# EasyEDA Pro project ProPrj_ESP32 Drone_2026-05-29.epro

# Schematic Schematic1

## Sheets
1 P1: Board Name: Board1; Create Date: 2025-12-19; Page Name: P1; Project Name: ESP32 Drone; Schematic Name: Schematic1; Update Date: 2026-03-31; Company: Sprig Labs; Drawn: K. Paraskevas; Page Size: A4; Version: V1.0
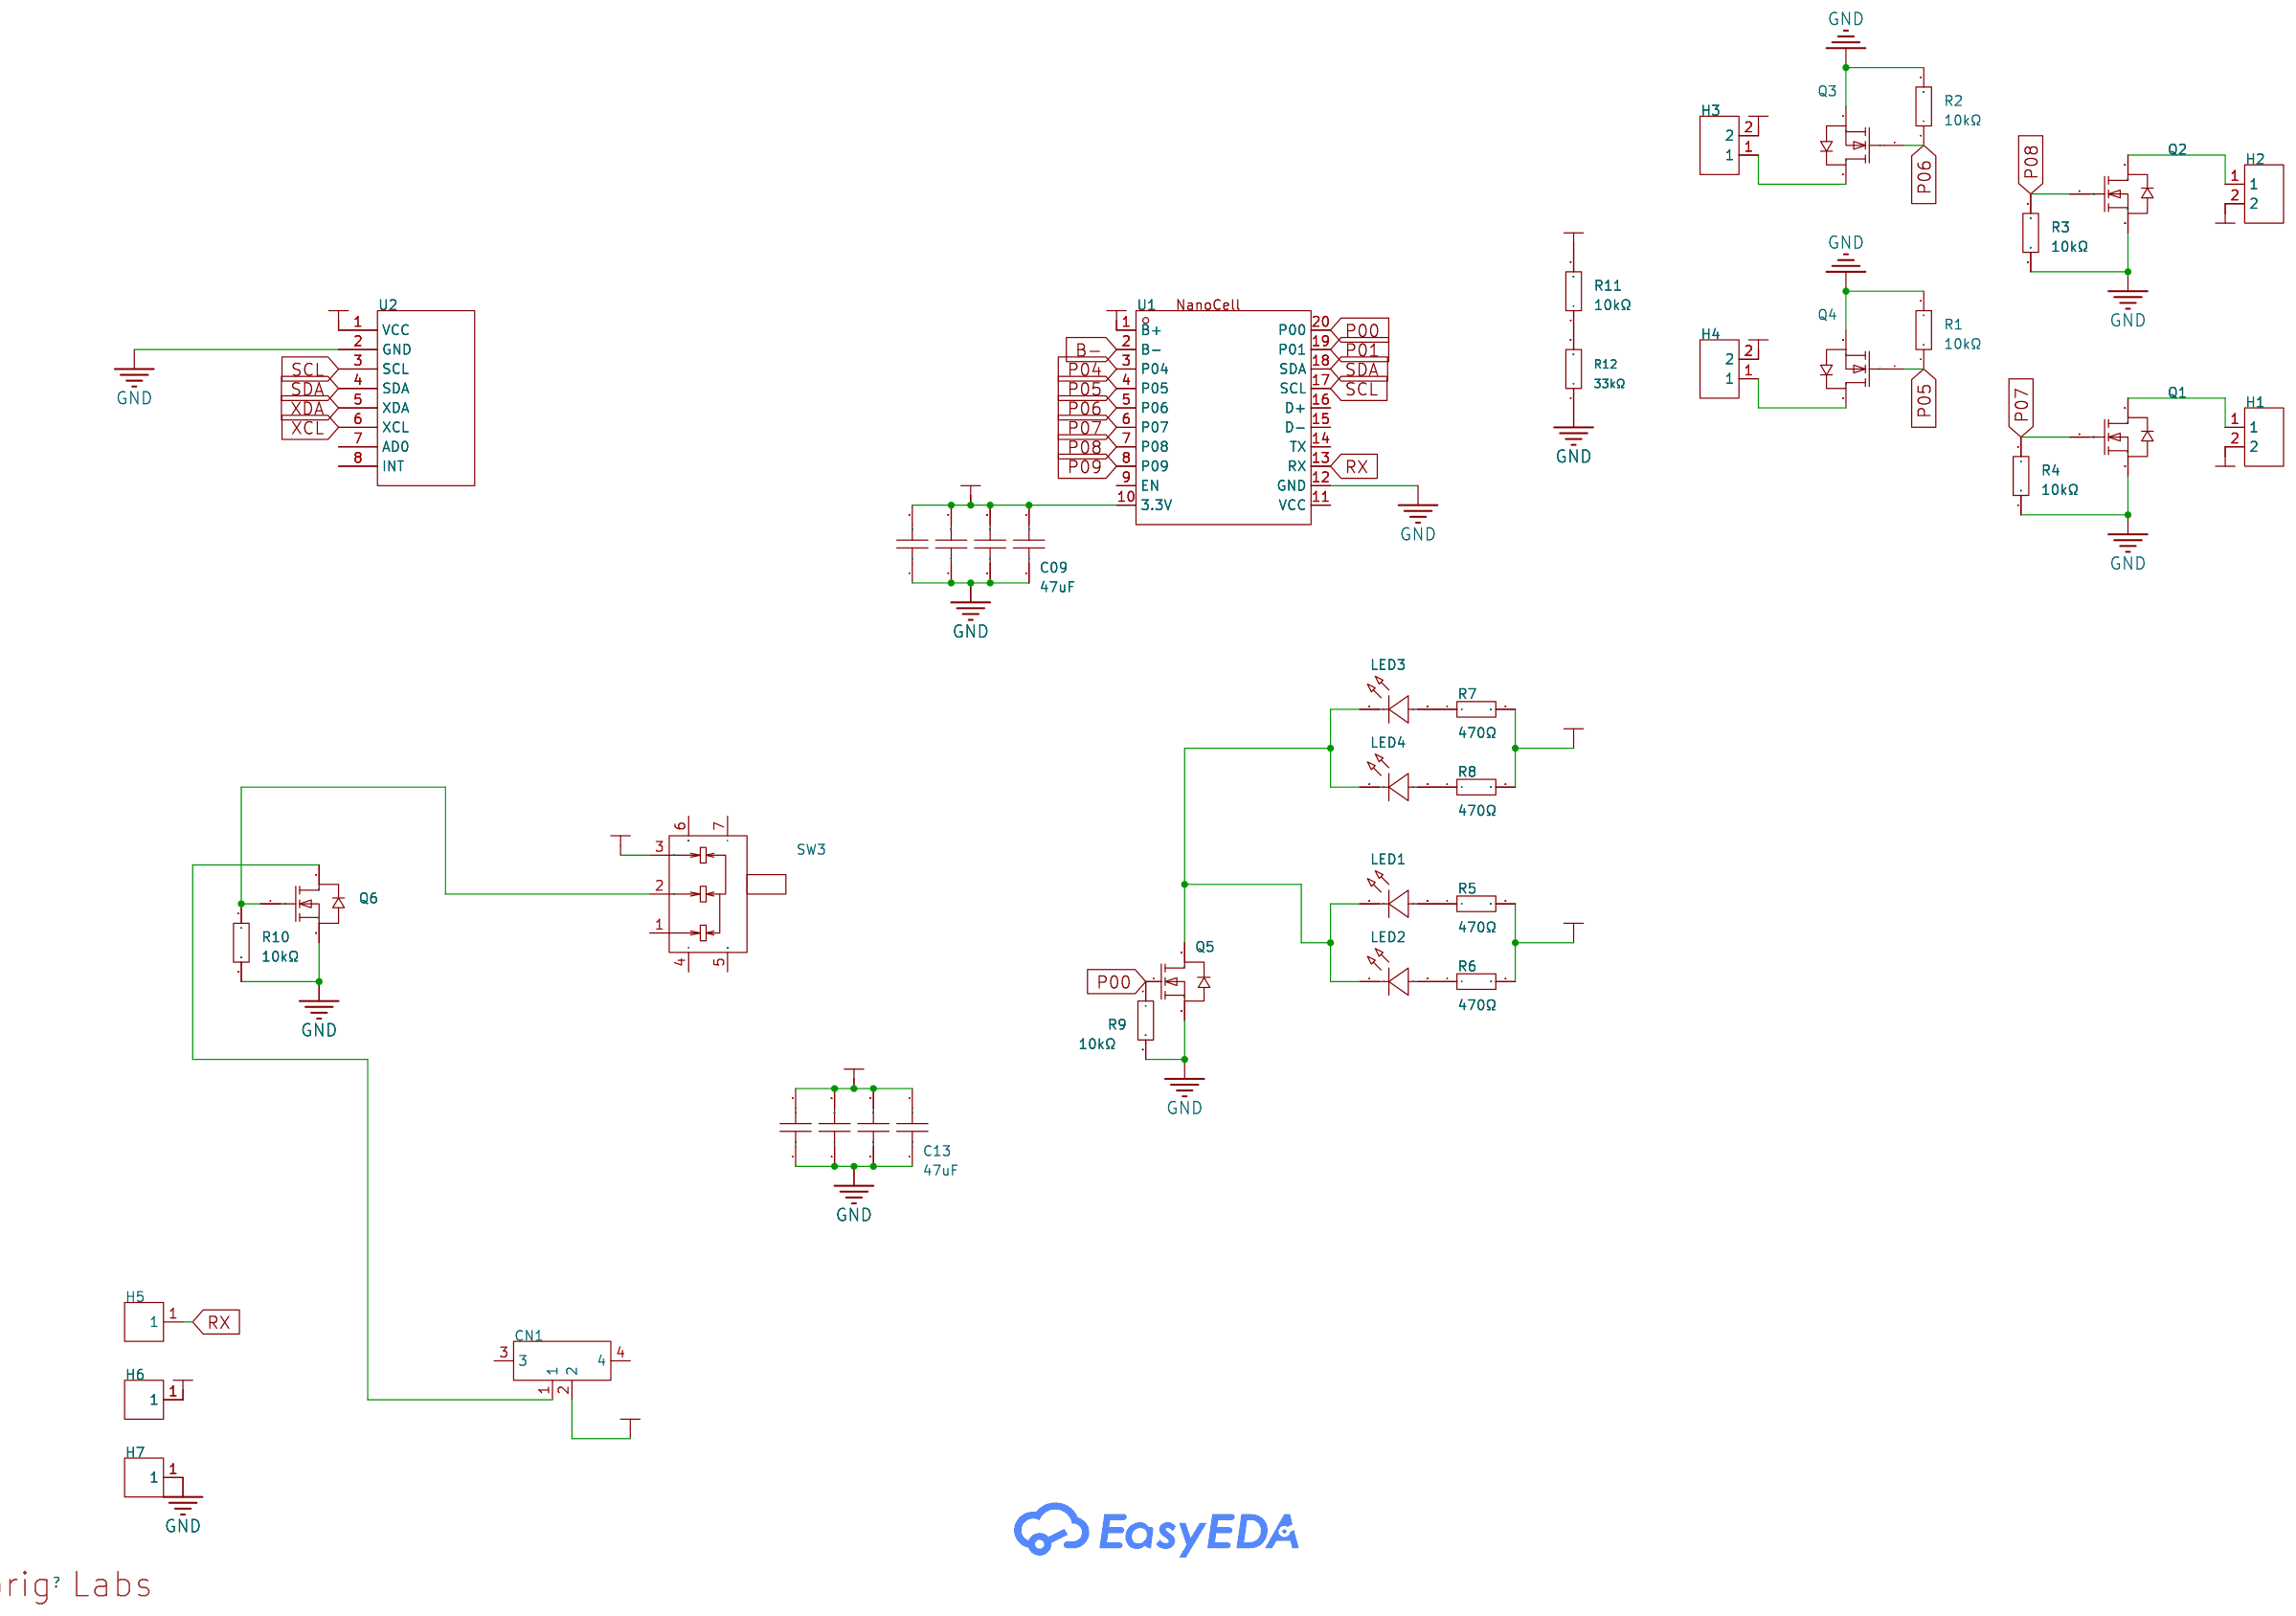
[diagram p0: P1]
2 P2: Create Date: 2026-03-29; Page Name: P2
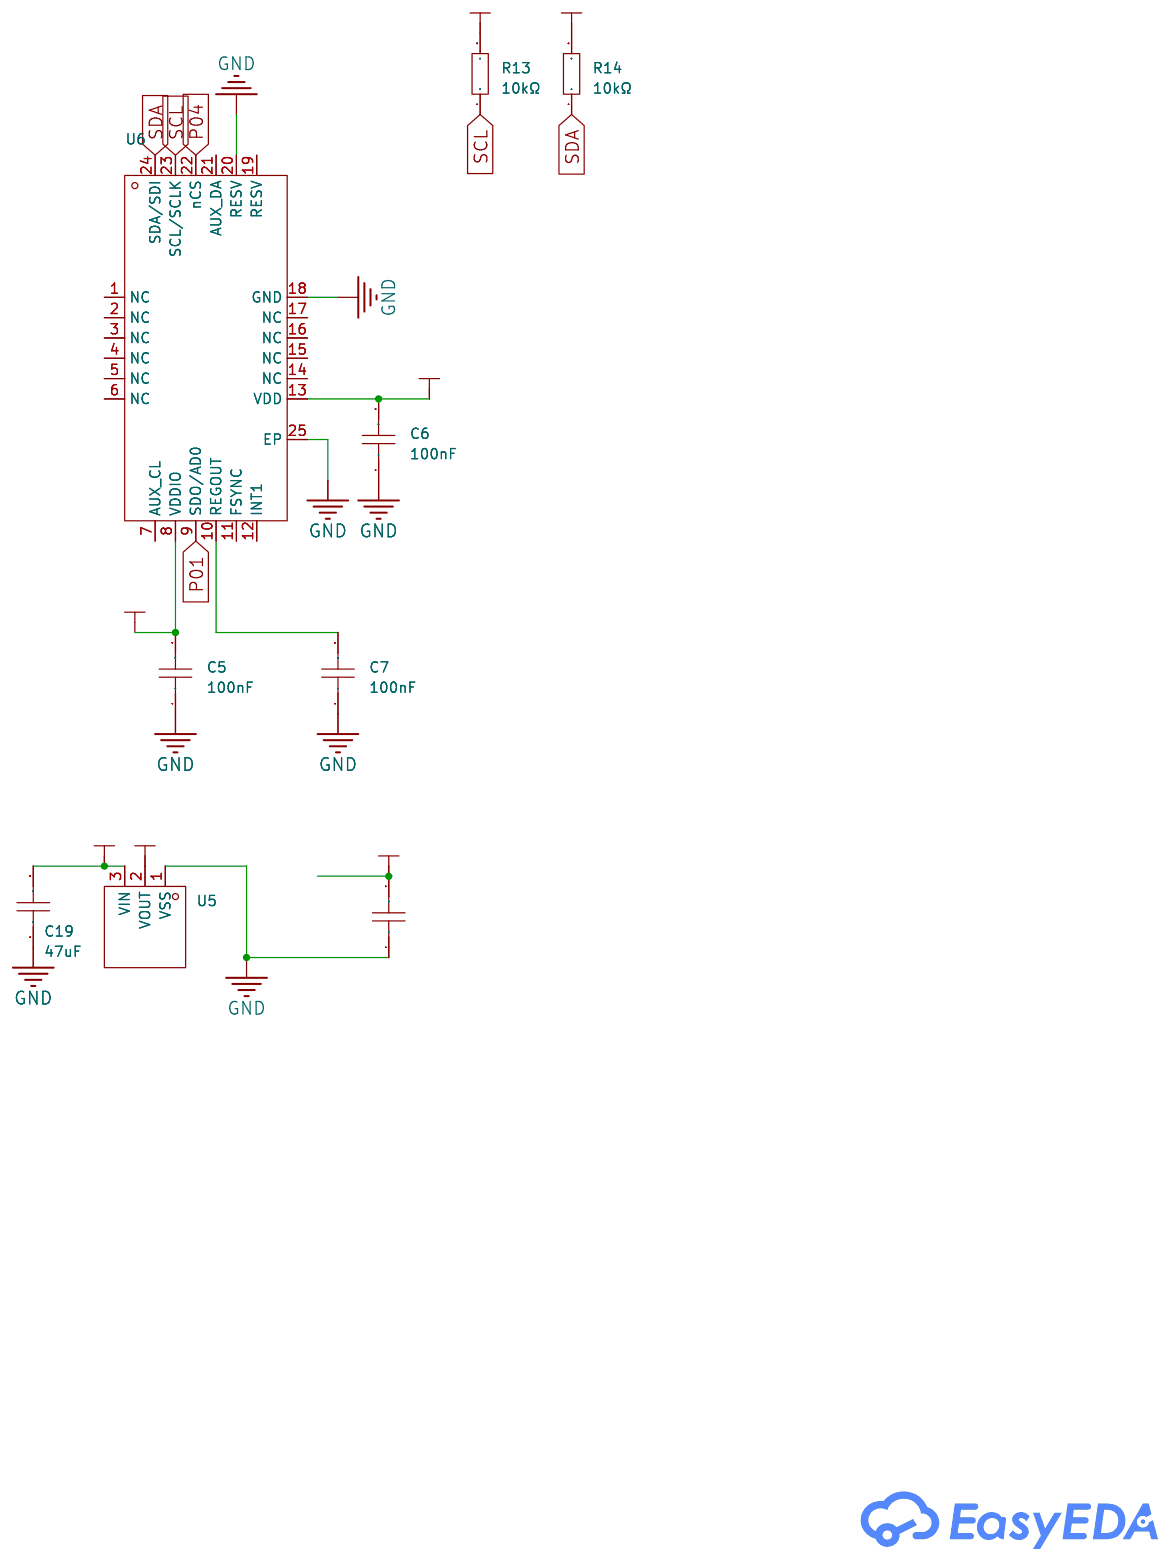
[diagram p1: P2]

## Parts
sheet P1
C09  47uF  [C0805]
C10  47uF  [C0805]
C11  47uF  [C0805]
C12  47uF  [C0805]
C13  47uF  [C0805]
C14  47uF  [C0805]
C15  47uF  [C0805]
C16  47uF  [C0805]
CN1  HX PH2.0-2PWT  [CONN-SMD_2P-P2.00]
H1  KF332J-3.5-2P BLACK  [HDR-TH_2P-P3.50-V-M_1]
H2  KF332J-3.5-2P BLACK  [HDR-TH_2P-P3.50-V-M_1]
H3  KF332J-3.5-2P BLACK  [HDR-TH_2P-P3.50-V-M_1]
H4  KF332J-3.5-2P BLACK  [HDR-TH_2P-P3.50-V-M_1]
H5  TMM-101-01-G-S  [HDR-TH_TMM-101-06-L-S]
H6  TMM-101-01-G-S  [HDR-TH_TMM-101-06-L-S]
H7  TMM-101-01-G-S  [HDR-TH_TMM-101-06-L-S]
LED1  XL-1608SURC-06  [LED0603-RD_RED]
LED2  XL-1608SURC-06  [LED0603-RD_RED]
LED3  PSC-1608U50GC-G4  [LED0603-RD_GREEN]
LED4  PSC-1608U50GC-G4  [LED0603-RD_GREEN]
Q1  100N03A  [TO-252-2_L6.6-W6.1-P4.57-LS9.9-BR-CW]
Q2  100N03A  [TO-252-2_L6.6-W6.1-P4.57-LS9.9-BR-CW]
Q3  100N03A  [TO-252-2_L6.6-W6.1-P4.57-LS9.9-BR-CW]
Q4  100N03A  [TO-252-2_L6.6-W6.1-P4.57-LS9.9-BR-CW]
Q5  SI2302-HXY  [SOT-23-3_L2.9-W1.3-P1.90-LS2.4-BR]
Q6  100N03A  [TO-252-2_L6.6-W6.1-P4.57-LS9.9-BR-CW]
R1  10kΩ  [R0603]
R2  10kΩ  [R0603]
R3  10kΩ  [R0603]
R4  10kΩ  [R0603]
R5  470Ω  [R0603]
R6  470Ω  [R0603]
R7  470Ω  [R0603]
R8  470Ω  [R0603]
R9  10kΩ  [R0603]
R10  10kΩ  [R0603]
R11  10kΩ  [R0603]  (no BOM)
R12  33kΩ  [R0603]  (no BOM)
SW3  MK-12C03-G015  [SW-SMD_MK-12C03-G015]
U1  -  [NanoCell]
U2  -  [MPU-6050 module]
sheet P2
C5  100nF  [C0603]
C6  100nF  [C0603]
C7  100nF  [C0603]
C17  47uF  [C0805]
C19  47uF  [C0805]
R13  10kΩ  [R0603]
R14  10kΩ  [R0603]
U5  XC6206P182MR  [SOT-23-3_L2.9-W1.6-P1.90-LS2.8-BR]
U6  ICM-20948  [QFN-24_L3.0-W3.0-P0.40-BL-EP]

## Library data of the parts
C09-C17 C19 = JMK212BJ476MG-T: Capacitance:47uF Tolerance:±20% Tolerance:±20% Voltage Rating:6.3V Temperature Coefficient:X5R; LCSC Part Name: 47uF ±20% 6.3V; Supplier Part: C87159; Manufacturer: TAIYO YUDEN(太诱); Supplier Footprint: 0805; JLCPCB Part Class: Extended Part; Datasheet: https://item.szlcsc.com/datasheet/JMK212BJ476MG-T/88337.html; Supplier: LCSC; Tolerance: ±20%; Voltage Rating: 6.3V; Temperature Coefficient: X5R
CN1 = HX PH2.0-2PWT: Pins Structure:1x2P Pitch:2mm Mounting Type:Surface Mount, Right Angle Reference Series:PH Number of Pins:2P Number of Rows:1 Number of PINs Per Row:2 Row Spacing:- Current Rating:2A Contact Material:Brass Contact Plating:Tin Operating Temperature:-25℃~+8; LCSC Part Name: 1x2P 间距:2mm 卧贴 系列:PH; Supplier Part: C22461285; Manufacturer: hanxia(韩下); Supplier Footprint: SMD,P=2mm,卧贴; JLCPCB Part Class: Extended Part; Datasheet: https://item.szlcsc.com/datasheet/HX%2520PH2.0-2PWT/24139203.html; Supplier: LCSC; Pins Structure: 1x2P; Pitch: 2mm; Mounting Type: Surface Mount, Right Angle; Reference Series: PH; Number of Pins: 2P; Number of Rows: 1; Number of PINs Per Row: 2; Current Rating: 2A; Contact Material: Brass; Contact Plating: Tin; Operating Temperature: -25℃~+85℃; Voltage Rating: 100V; Plastic Material: LCP; Flame Retardant Rating: UL94V-0; Color: Beige
H1-H4 = KF332J-3.5-2P BLACK: Pin Structure:1x2P Pitch:3.5mm Row Spacing:- Circluar Pins/Square Pins:Round Pin Mounting Type:Through Hole Number of Rows:1 Number of Pins:2P Insulation Height:2mm Length of End Connection Pin:3.5mm Contact Material:Copper alloy Contact Plating:Tin Opera; LCSC Part Name: 1x2P 间距:3.5mm 圆针 直插; Supplier Part: C19711761; Manufacturer: KEFA(科发); Supplier Footprint: 插件,P=3.5mm; JLCPCB Part Class: Extended Part; Datasheet: https://item.szlcsc.com/datasheet/KF332J-3.5-2P%2520BLACK/21021586.html; Supplier: LCSC; Pin Structure: 1x2P; Pitch: 3.5mm; Circluar Pins/Square Pins: Round Pin; Mounting Type: Through Hole; Number of Rows: 1; Number of Pins: 2P; Insulation Height: 2mm; Length of End Connection Pin: 3.5mm; Contact Material: Copper alloy; Contact Plating: Tin; Operating Temperature: -30℃~+120℃; Color: Black
H5-H7 = TMM-101-01-G-S: Mounting Type:Through Hole Number of Rows:1 Number of Pins:1P Current Rating:3.2A Contact Material:Phosphor Bronze Contact Plating:Gold Operating Temperature:-55℃~+125℃ Operating Temperature:-55℃~+125℃ Color:Black; LCSC Part Name: 直插; Supplier Part: C5986197; Manufacturer: SAMTEC; Supplier Footprint: 插件; JLCPCB Part Class: Extended Part; Datasheet: https://item.szlcsc.com/datasheet/TMM-101-01-G-S/6924381.html; Supplier: LCSC; Mounting Type: Through Hole; Number of Rows: 1; Number of Pins: 1P; Current Rating: 3.2A; Contact Material: Phosphor Bronze; Contact Plating: Gold; Operating Temperature: -55℃~+125℃; Color: Black
LED1 LED2 = XL-1608SURC-06: Lamp Holder Type:- Illumination Color:Red Voltage - Forward(Vf):2.3V Voltage - Forward(Vf):2.3V Power(Watts):50mW Forward Current:20mA Wavelength - Dominant:620nm~630nm Wavelength - Dominant:620nm~630nm Peak Wavelength:625nm Diode Configuration:- Lens Col; LCSC Part Name: 0603红色贴片式发光二极管; Supplier Part: C965799; Manufacturer: XINGLIGHT(成兴光); Supplier Footprint: 0603; JLCPCB Part Class: Extended Part; Datasheet: https://item.szlcsc.com/datasheet/XL-1608SURC-06/1051408.html; Supplier: LCSC; Illumination Color: Red; Voltage - Forward(Vf): 2.3V; Power(Watts): 50mW; Forward Current: 20mA; Wavelength - Dominant: 620nm~630nm; Peak Wavelength: 625nm; Lens Color: Water Clear; Luminous Intensity: 225mcd; Viewing Angle: 120°; Mounting Style: op View Mount; Operating Temperature: -40℃~+85℃
LED3 LED4 = PSC-1608U50GC-G4: Illumination Color:Green Voltage - Forward(Vf):3.2V Voltage - Forward(Vf):3.2V Power(Watts):66mW Forward Current:10mA Wavelength - Dominant:517nm~527nm Wavelength - Dominant:517nm~527nm Lens Color:Water Clear Luminous Intensity:1000mcd Luminous Intensity:; LCSC Part Name: 钻孔1608高亮绿灯; Supplier Part: C22371298; Manufacturer: HONGLITRONIC(鸿利光电); Supplier Footprint: 0603; JLCPCB Part Class: Extended Part; Datasheet: https://item.szlcsc.com/datasheet/PSC-1608U50GC-G4/23857065.html; Supplier: LCSC; Illumination Color: Green; Voltage - Forward(Vf): 3.2V; Power(Watts): 66mW; Forward Current: 10mA; Wavelength - Dominant: 517nm~527nm; Lens Color: Water Clear; Luminous Intensity: 1000mcd; Viewing Angle: 130°; Operating Temperature: -40℃~+85℃
Q1-Q4 Q6 = 100N03A: Number:1 N-Channel Drain to Source Voltage:30V Current - Continuous Drain(Id):90A RDS(on):3.8mΩ@10V；6.4mΩ@4.5V Pd - Power Dissipation:105W Gate Threshold Voltage (Vgs(th)):1.7V@250uA Gate Charge(Qg):41nC@10V Input Capacitance(Ciss):1.963nF@15V Reverse Tra; LCSC Part Name: 1个N沟道 耐压:30V 电流:90A; Supplier Part: C668200; Manufacturer: UMW(友台半导体); Supplier Footprint: TO-252; JLCPCB Part Class: Extended Part; Datasheet: https://item.szlcsc.com/datasheet/100N03A/698048.html; Supplier: LCSC; Number: 1 N-Channel; Drain to Source Voltage: 30V; Current - Continuous Drain(Id): 90A; RDS(on): 3.8mΩ@10V；6.4mΩ@4.5V; Pd - Power Dissipation: 105W; Gate Threshold Voltage (Vgs(th)): 1.7V@250uA; Gate Charge(Qg): 41nC@10V; Input Capacitance(Ciss): 1.963nF@15V; Reverse Transfer Capacitance (Crss@Vds): 221pF; Operating Temperature: -55℃~+150℃; Type: N-Channel
Q5 = SI2302-HXY: Type:1 N-channel Drain Source Voltage (Vdss): Continuous Drain Current (Id): Drain Source On Resistance (RDS(on)@Vgs,Id):55mΩ@4.5V,2.8A Power Dissipation (Pd):900mW Gate Threshold Voltage (Vgs(th)@Id):1.2V@250uA Total Gate Charge (Qg@Vgs):5nC@4.5V Input C; LCSC Part Name: 1个N沟道 耐压:20V 电流:2.8A; Supplier Part: C4748714; Manufacturer: HXY MOSFET(华轩阳电子); Supplier Footprint: SOT-23; JLCPCB Part Class: Extended Part; Datasheet: https://atta.szlcsc.com/upload/public/pdf/source/20220720/B2EC63D46AD65363D9D3692163B46869.pdf; Supplier: LCSC; Type: 1 N-channel; Drain Source On Resistance (RDS(on)@Vgs,Id): 55mΩ@4.5V,2.8A; Power Dissipation (Pd): 900mW; Gate Threshold Voltage (Vgs(th)@Id): 1.2V@250uA; Total Gate Charge (Qg@Vgs): 5nC@4.5V; Input Capacitance (Ciss@Vds): 260pF; Reverse Transfer Capacitance (Crss@Vds): 27pF; Operating Temperature: -55℃~+150℃
R1-R4 R9-R11 R13 R14 = 0603WAF1002T5E: Type:Thick Film Resistor Resistance:10kΩ Tolerance:±1% Tolerance:±1% Power(Watts):100mW Voltage-Supply(Max):75V Temperature Coefficient:±100ppm/℃ Temperature Coefficient:±100ppm/℃ Operating Temperature:-55℃~+155℃ Operating Temperature:-55℃~+155℃; LCSC Part Name: 厚膜电阻 10kΩ ±1% 100mW; Supplier Part: C25804; Manufacturer: UNI-ROYAL(厚声); Supplier Footprint: 0603; JLCPCB Part Class: Basic Part; Datasheet: https://item.szlcsc.com/datasheet/0603WAF1002T5E/26547.html; Supplier: LCSC; Type: Thick Film Resistor; Tolerance: ±1%; Power(Watts): 100mW; Voltage-Supply(Max): 75V; Temperature Coefficient: ±100ppm/℃; Operating Temperature: -55℃~+155℃
R5-R8 = 0603WAF4700T5E: Type:Thick Film Resistor Resistance:470Ω Tolerance:±1% Tolerance:±1% Power(Watts):100mW Voltage-Supply(Max):75V Temperature Coefficient:±100ppm/℃ Temperature Coefficient:±100ppm/℃ Operating Temperature:-55℃~+155℃ Operating Temperature:-55℃~+155℃; LCSC Part Name: 470Ω ±1% 100mW 厚膜电阻; Supplier Part: C23179; Manufacturer: UNI-ROYAL(厚声); Supplier Footprint: 0603; JLCPCB Part Class: Basic Part; Datasheet: https://item.szlcsc.com/datasheet/0603WAF4700T5E/23906.html; Supplier: LCSC; Type: Thick Film Resistor; Tolerance: ±1%; Power(Watts): 100mW; Voltage-Supply(Max): 75V; Temperature Coefficient: ±100ppm/℃; Operating Temperature: -55℃~+155℃
R12 = 0603WAF3302T5E: Type:Thick Film Resistor Resistance:33kΩ Tolerance:±1% Tolerance:±1% Power(Watts):100mW Voltage-Supply(Max):75V Temperature Coefficient:±100ppm/℃ Temperature Coefficient:±100ppm/℃ Operating Temperature:-55℃~+155℃ Operating Temperature:-55℃~+155℃; LCSC Part Name: 33kΩ ±1% 100mW 厚膜电阻; Supplier Part: C4216; Manufacturer: UNI-ROYAL(厚声); Supplier Footprint: 0603; JLCPCB Part Class: Basic Part; Datasheet: https://item.szlcsc.com/datasheet/0603WAF3302T5E/4623.html; Supplier: LCSC; Type: Thick Film Resistor; Tolerance: ±1%; Power(Watts): 100mW; Voltage-Supply(Max): 75V; Temperature Coefficient: ±100ppm/℃; Operating Temperature: -55℃~+155℃
SW3 = MK-12C03-G015: Circuit:SPDT Actuator Style:Rectangular columnar Pin Style:SMDSplicing Switch Length:6.65mm Switch Width:2.75mm Switch Height:4.25mm Mounting Style:卧贴 Actuator Color:White Current Rating (DC):1A Voltage Rating (DC):6V Mechanical Life:1万次 Operating Tempera; LCSC Part Name: 新七脚小拨动开关 G1.5mm; Supplier Part: C2890358; Manufacturer: G-Switch(品赞); Supplier Footprint: SMD; JLCPCB Part Class: Extended Part; Datasheet: https://atta.szlcsc.com/upload/public/pdf/source/20240612/7D979AF25627BA0CE326E7EBF8EC90FA.pdf; Supplier: LCSC; Circuit: SPDT; Actuator Style: Rectangular columnar; Pin Style: SMDSplicing; Switch Length: 6.65mm; Switch Width: 2.75mm; Switch Height: 4.25mm; Mounting Style: 卧贴; Actuator Color: White; Current Rating (DC): 1A; Voltage Rating (DC): 6V; Mechanical Life: 1万次; Operating Temperature: -20℃~+70℃
U1 = NanoCell
U2 = MPU-6050 module
C5-C7 = CC0603KRX7R9BB104: Capacitance:100nF Tolerance:±10% Tolerance:±10% Voltage Rating:50V Temperature Coefficient:X7R; LCSC Part Name: 100nF ±10% 50V; Supplier Part: C14663; Manufacturer: YAGEO(国巨); Supplier Footprint: 0603; JLCPCB Part Class: Basic Part; Datasheet: https://item.szlcsc.com/datasheet/CC0603KRX7R9BB104/15331.html; Supplier: LCSC; Tolerance: ±10%; Voltage Rating: 50V; Temperature Coefficient: X7R
U5 = XC6206P182MR_C22466430: Output Type:Fixed Maximum Input Voltage:6.5V Output Voltage:1.8V Output Voltage:1.8V Output Current:- Power Supply Rejection Ratio (PSRR):- Feature:Short-Circuit  Protection；Overcurrent Protection(OCP) Operating Temperature:-40℃~+85℃ Operating Temperature; LCSC Part Name: 线性稳压器(LDO); Supplier Part: C22466430; Manufacturer: TDSEMIC(拓电半导体); Supplier Footprint: SOT-23-3; JLCPCB Part Class: Extended Part; Datasheet: https://atta.szlcsc.com/upload/public/pdf/source/20240614/B6555AFA0F407D7F7E5A5C102A178C3B.pdf; Supplier: LCSC; Output Type: Fixed; Maximum Input Voltage: 6.5V; Output Voltage: 1.8V; Feature: Short-Circuit  Protection；Overcurrent Protection(OCP); Operating Temperature: -40℃~+85℃; Output Polarity: Positive electrode; Number of Outputs: 1
U6 = ICM-20948: Accelerometer Sensing Axis:X,Y,Z Acceleration Measurement Range (MAX):±16g Acceleration Measurement Range (MAX):±16g Gyroscope Sensing Axis:X,Y,Z Gyroscope Measurement Range (MAX):±2000dps Gyroscope Measurement Range (MAX):±2000dps Sensor Type:Acceleromet; LCSC Part Name: 九轴MEMS运动追踪器件; Supplier Part: C726001; Manufacturer: TDK InvenSense(应美盛); Supplier Footprint: QFN-24(3x3); JLCPCB Part Class: Extended Part; Datasheet: https://item.szlcsc.com/datasheet/ICM-20948/772651.html; Supplier: LCSC; Accelerometer Sensing Axis: X,Y,Z; Acceleration Measurement Range (MAX): ±16g; Gyroscope Sensing Axis: X,Y,Z; Gyroscope Measurement Range (MAX): ±2000dps; Sensor Type: Accelerometer Gyroscope; Output Bits: 16bit; Interface: I2C；SPI; Voltage - Supply: 1.71V~3.6V; Cache Size: 0.5KB; Standby Current: 8uA; Operating Temperature: -40℃~+85℃

## Nets
1.8V: C5.2 C17.2 R13.2 R14.2 U5.2(VOUT) U6.8(VDDIO)
+3.3V: C6.2 C09.2 C10.2 C11.2 C12.2 C19.2 H6.1 U1.10(3.3V) U2.1(VCC) U5.3(VIN) U6.13(VDD)
+VBAT: C13.2 C14.2 C15.2 C16.2 CN1.2 H1.2 H2.2 H3.2 H4.2 R5.2 R6.2 R7.2 R8.2 R11.2 SW3.3 U1.1(B+)
GND: C5.1 C6.1 C7.1 C09.1 C10.1 C11.1 C12.1 C13.1 C14.1 C15.1 C16.1 C17.1 C19.1 H7.1 Q1.3(S) Q2.3(S) Q3.3(S) Q4.3(S) Q5.2(S) Q6.3(S) R1.2 R2.2 R3.2 R4.2 R9.2 R10.2 R12.1 U1.12(GND) U2.2(GND) U5.1(VSS) U6.18(GND) U6.20(RESV) U6.25(EP)
B-: U1.2(B-)
P00: Q5.1(G) R9.1 U1.20(P00)
P01: R11.1 R12.2 U1.19(P01) U6.9(SDO/AD0)
P04: U1.3(P04) U6.22(nCS)
P05: Q4.1(G) R1.1 U1.4(P05)
P06: Q3.1(G) R2.1 U1.5(P06)
P07: Q1.1(G) R4.1 U1.6(P07)
P08: Q2.1(G) R3.1 U1.7(P08)
P09: U1.8(P09)
RX: H5.1 U1.13(RX)
SCL: R13.1 U1.17(SCL) U2.3(SCL) U6.23(SCL/SCLK)
SDA: R14.1 U1.18(SDA) U2.4(SDA) U6.24(SDA/SDI)
XCL: U2.6(XCL)
XDA: U2.5(XDA)
$1N990: H3.1 Q3.2(D)
$1N1042: H4.1 Q4.2(D)
$1N1143: H1.1 Q1.2(D)
$1N1147: H2.1 Q2.2(D)
$1N3735: LED1.2(A) R5.1
$1N3774: LED2.2(A) R6.1
$1N3813: LED3.2(A) R7.1
$1N3852: LED4.2(A) R8.1
$1N5655: LED1.1(K) LED2.1(K) LED3.1(K) LED4.1(K) Q5.3(D)
$1N12497: Q6.1(G) R10.1 SW3.2
$2N590: C7.2 U6.10(REGOUT)
Net-(CN1-1): CN1.1 Q6.2(D)

Not connected (* = marked no-connect by the designer): CN1 3 4; SW3 1 4 5 6 7; U1 9(EN) 11(VCC) 14(TX) 15(D-) 16(D+); U2 7(AD0) 8(INT); U6 1(NC) 2(NC) 3(NC) 4(NC) 5(NC) 6(NC) 7(AUX_CL) 11(FSYNC) 12(INT1) 14(NC) 15(NC) 16(NC) 17(NC) 19(RESV) 21(AUX_DA)

# Board PCB1
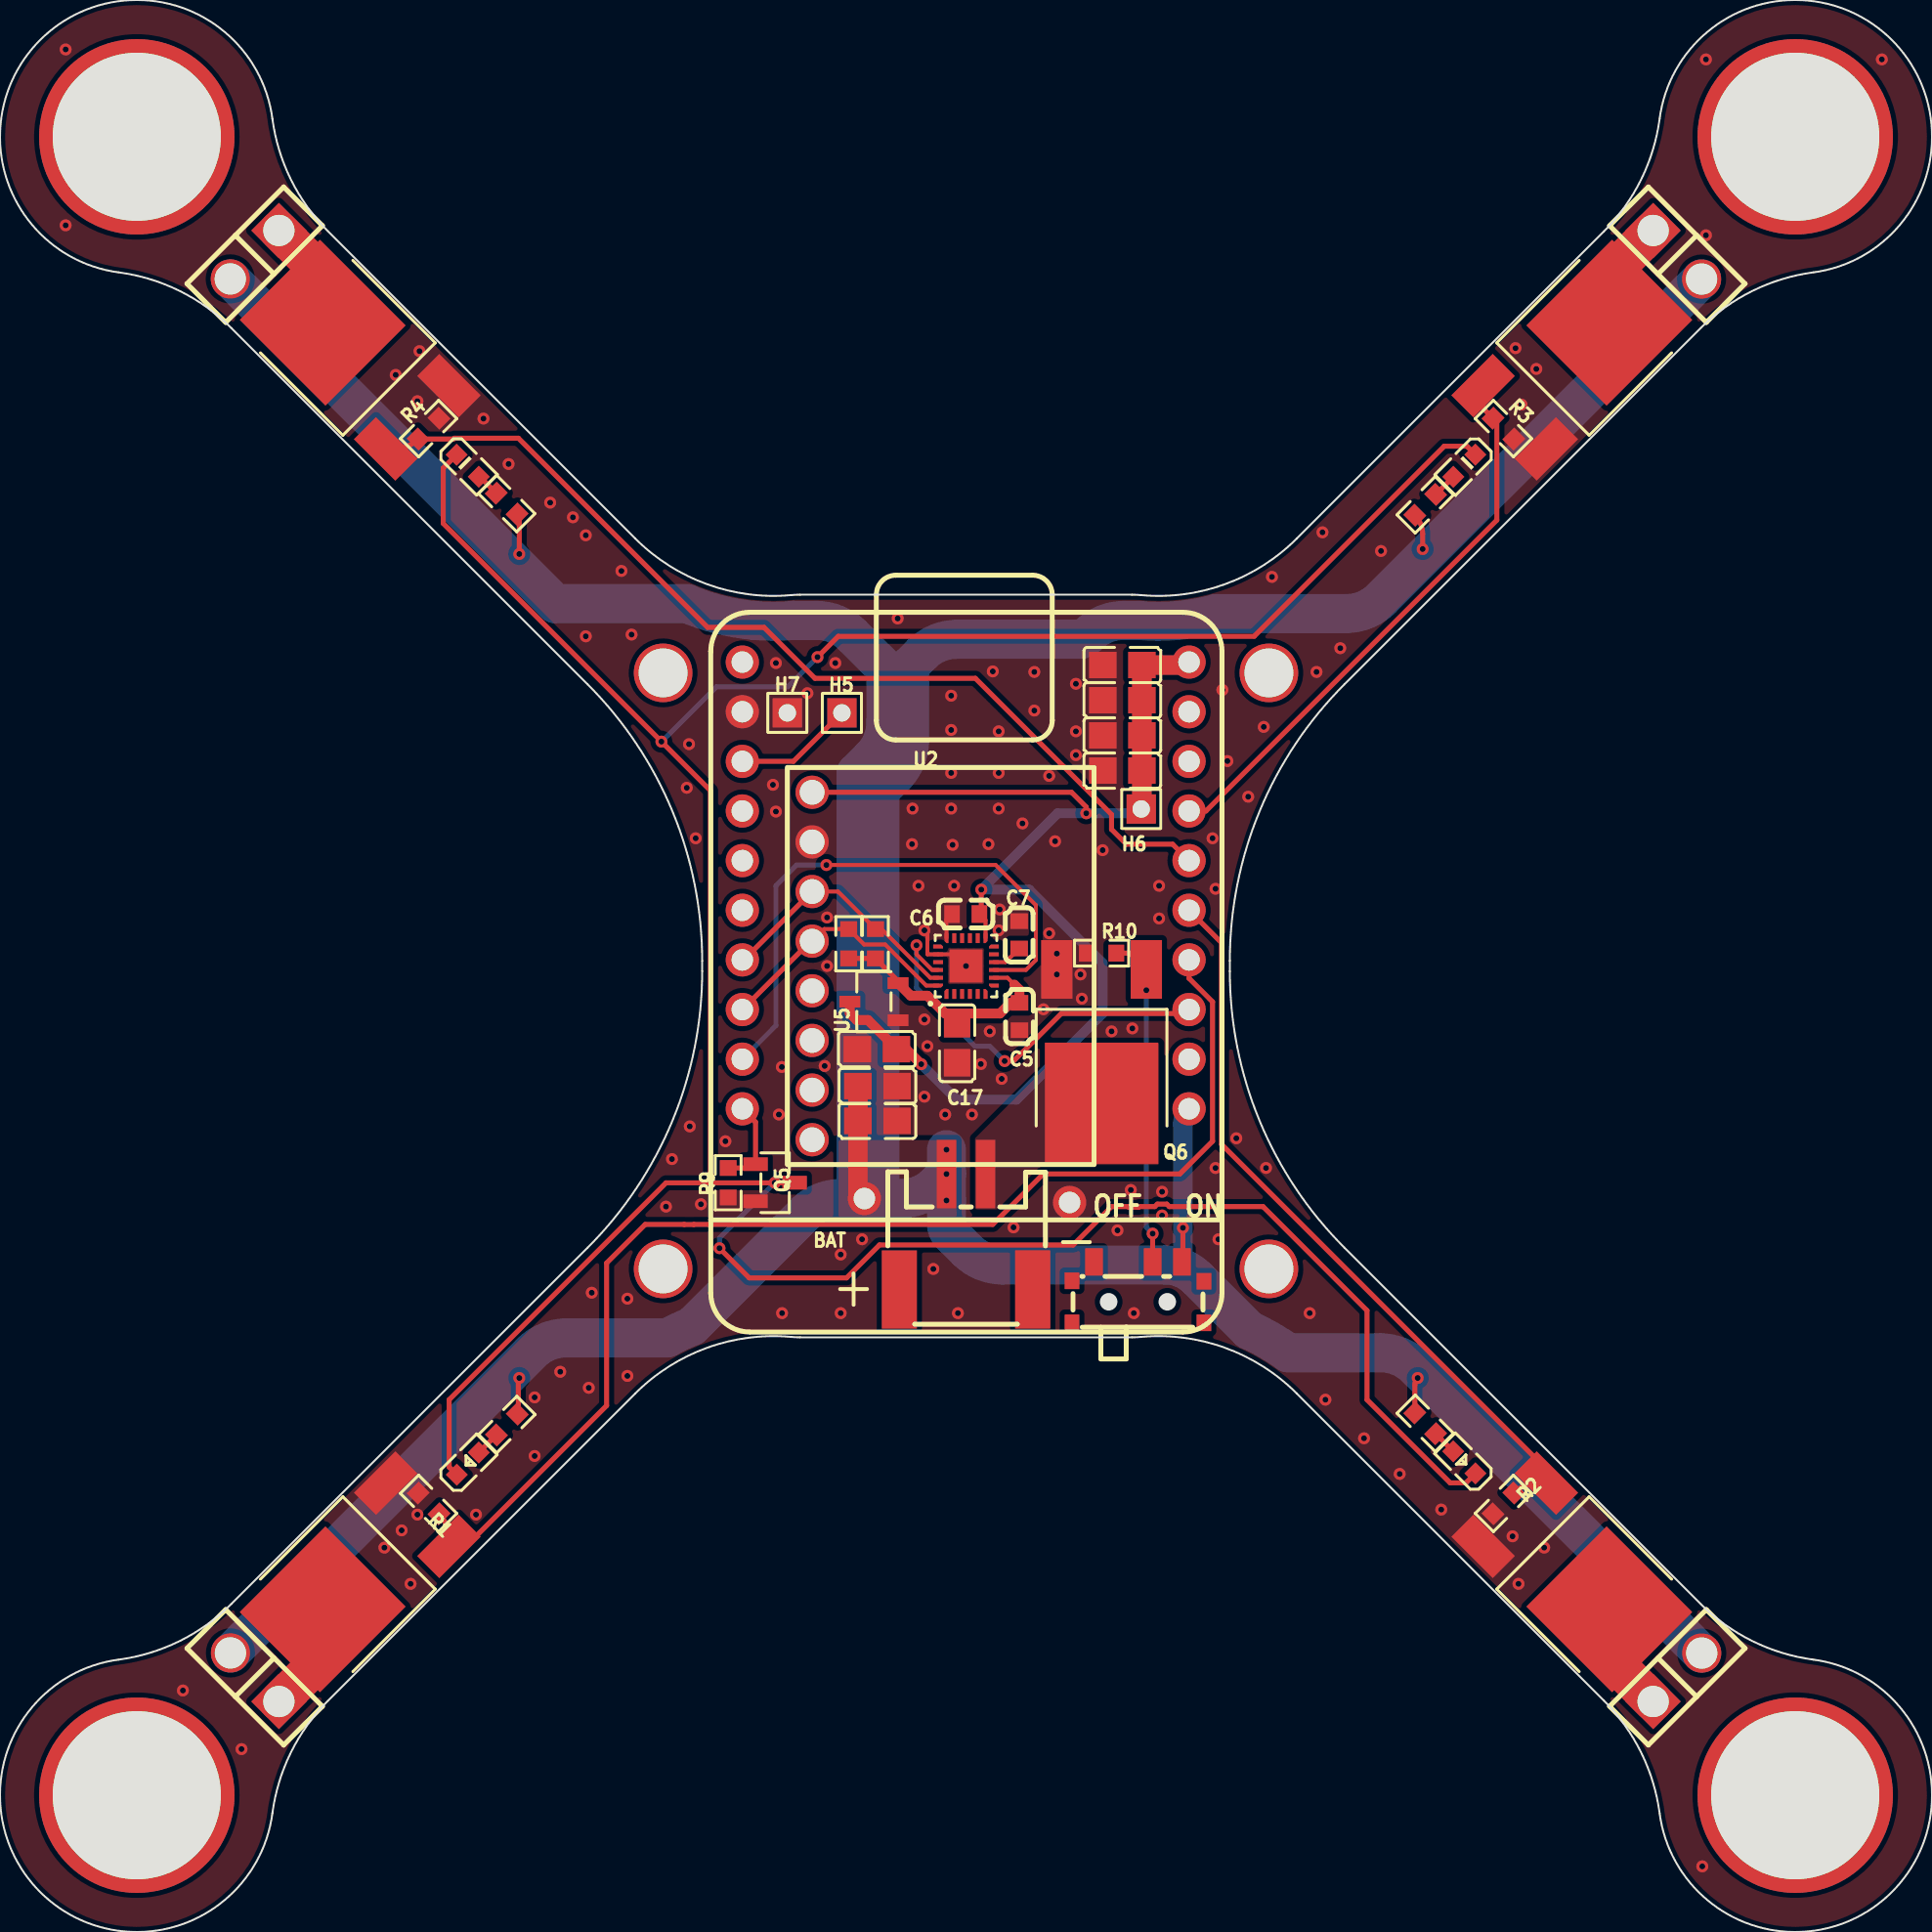
[diagram p2: board, top side]
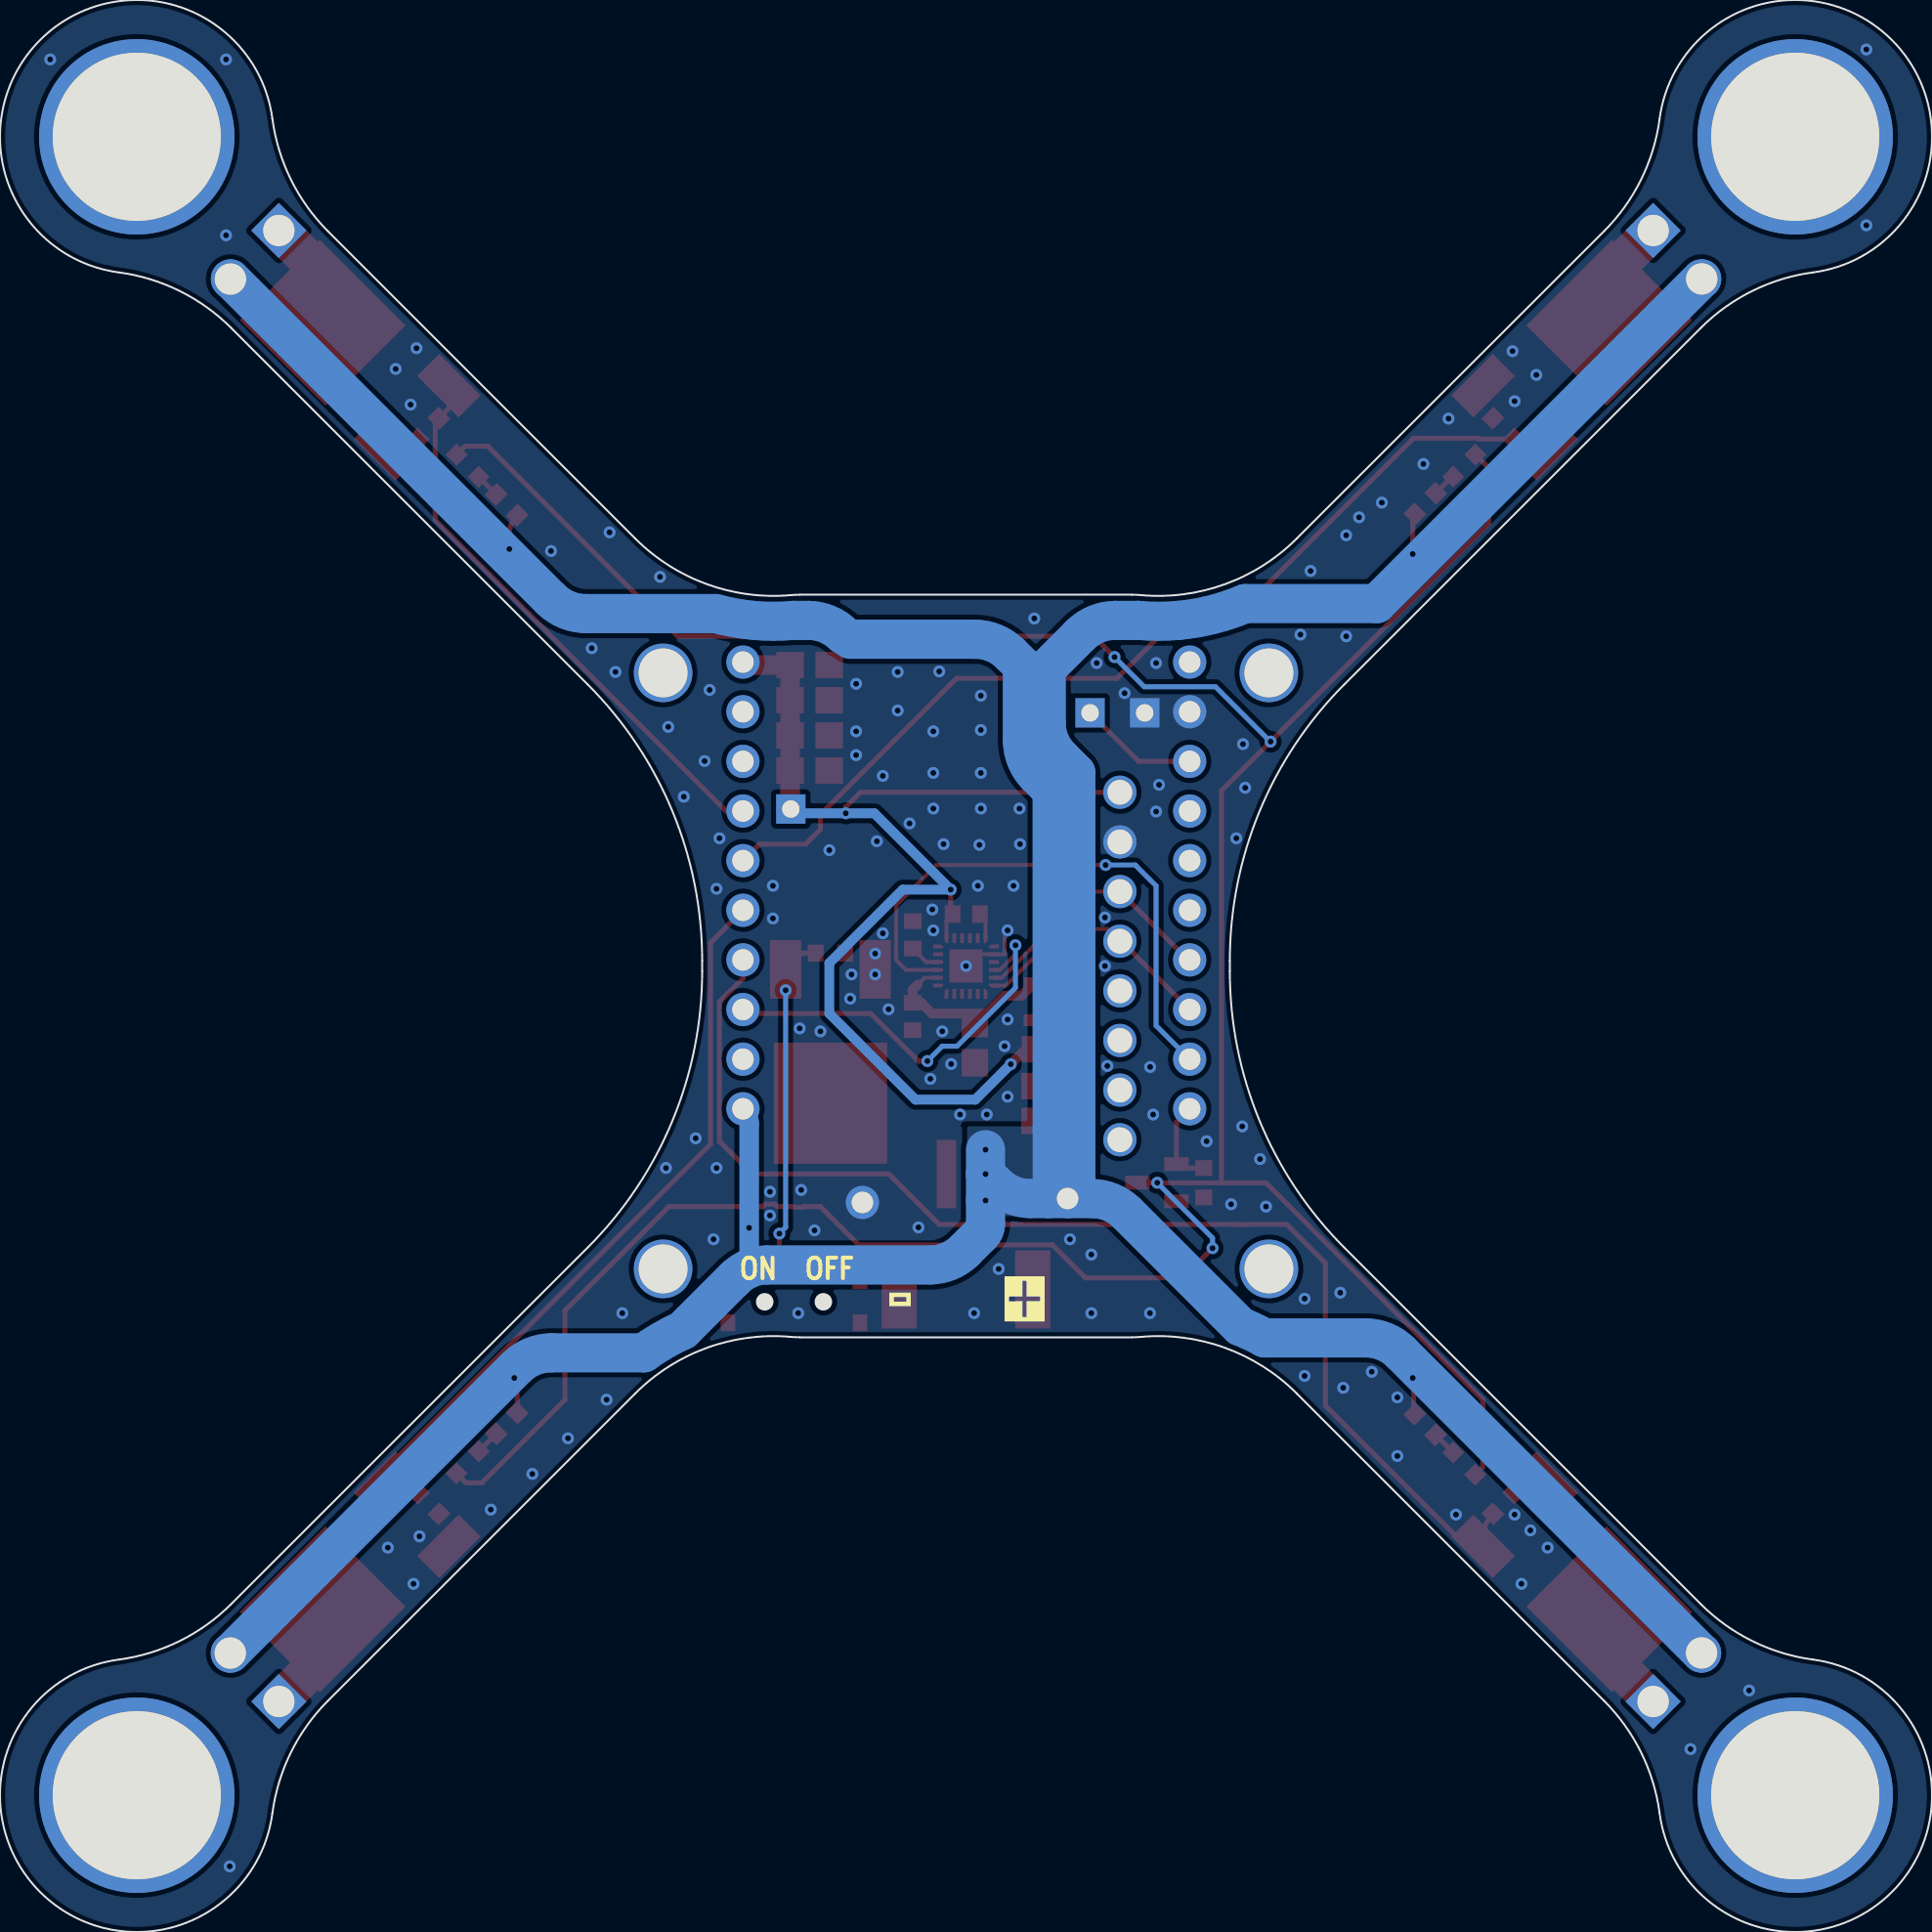
[diagram p3: board, bottom side, seen from below]

Outline 98.87 x 98.87 mm; copper layers: Top Layer, Bottom Layer. Coordinates in mm from the lower left corner of the outline.
Outline path: 6.08,84.93 arc(9.19,83.98) 11.83,82.08 30.07,63.84 arc(34.41,57.35) 35.93,49.7 35.93,49.17 arc(34.41,41.51) 30.07,35.02 11.83,16.78 arc(9.19,14.89) 6.08,13.94 arc(2.05,2.05) 13.94,6.08 arc(14.89,9.19) 16.78,11.83 32.51,27.56 arc(36.18,29.89) 40.48,30.45 arc(40.71,30.44) 40.93,30.43 57.93,30.43 arc(58.16,30.44) 58.38,30.45 arc(62.69,29.89) 66.35,27.56 82.08,11.83 arc(83.98,9.19) 84.93,6.08 arc(96.81,2.05) 92.79,13.94 arc(89.68,14.89) 87.03,16.78 68.79,35.02 arc(64.45,41.51) 62.93,49.17 62.93,49.7 arc(64.45,57.35) 68.79,63.84 87.03,82.08 arc(89.68,83.98) 92.79,84.93 arc(96.81,96.81) 84.93,92.79 arc(83.98,89.68) 82.08,87.03 66.35,71.3 arc(62.69,68.97) 58.38,68.41 arc(58.16,68.43) 57.93,68.43 40.93,68.43 arc(40.71,68.43) 40.48,68.41 arc(36.18,68.97) 32.51,71.3 16.78,87.03 arc(14.89,89.68) 13.94,92.79 arc(2.05,96.81) 6.08,84.93
Stack: Top Layer 0.035mm / Dielectric1 1.51mm FR4 er 4.5 / Bottom Layer 0.035mm

## Design rules (mm)
template: Custom Config
spacing copperThickness1oz (default): track to track 0.102, other pairs 0.152 to 0.3
spacing copperThickness2oz: track to track 0.203, other pairs 0.152 to 0.3
track width copperThickness1oz (default): min 0.127, default 0.254, max 2.54
track width copperThickness2oz: min 0.203, default 0.254, max 2.54
differential pair differentialPair (default): width min 0.127, default 0.254, max 2.54; gap min 0.152, default 0.152
via viaSize (default): diameter min 0.5, default 0.61, max 10; hole min 0.3, default 0.305, max 6.3
net +VBAT uses solid
net GND uses solid
net B- uses solid
net $1N11155 uses solid

## Placement (name value [footprint] x y rotation side)
BAT  HX PH2.0-2PWT  [CONN-SMD_2P-P2.00]  49.43 35.83 0 top
C5  100nF  [C0603]  52.17 46.85 90 top
C6  100nF  [C0603]  49.42 52.09 0 top
C7  100nF  [C0603]  52.15 51.03 270 top
C09  47uF  [C0805]  57.43 59.43 0 top
C10  47uF  [C0805]  57.43 61.23 0 top
C11  47uF  [C0805]  57.43 63.03 0 top
C12  47uF  [C0805]  57.43 64.83 0 top
C15  47uF  [C0805]  44.9 43.29 180 top
C16  47uF  [C0805]  44.9 41.51 180 top
C17  47uF  [C0805]  48.98 45.48 90 top
C19  47uF  [C0805]  44.87 45.18 0 top
H1  KF332J-3.5-2P BLACK  [HDR-TH_2P-P3.50-V-M_1]  13.03 85.83 225 top
H2  KF332J-3.5-2P BLACK  [HDR-TH_2P-P3.50-V-M_1]  85.83 85.83 315 top
H3  KF332J-3.5-2P BLACK  [HDR-TH_2P-P3.50-V-M_1]  85.83 13.03 45 top
H4  KF332J-3.5-2P BLACK  [HDR-TH_2P-P3.50-V-M_1]  13.03 13.03 135 top
H5  TMM-101-01-G-S  [HDR-TH_TMM-101-06-L-S]  43.08 62.39 0 top
H6  TMM-101-01-G-S  [HDR-TH_TMM-101-06-L-S]  58.4 57.47 0 top
H7  TMM-101-01-G-S  [HDR-TH_TMM-101-06-L-S]  40.29 62.39 0 top
LED1  XL-1608SURC-06  [LED0603-RD_RED]  23.94 23.97 45 top
LED2  XL-1608SURC-06  [LED0603-RD_RED]  74.93 24.03 135 top
LED3  PSC-1608U50GC-G4  [LED0603-RD_GREEN]  23.93 75.03 315 top
LED4  PSC-1608U50GC-G4  [LED0603-RD_GREEN]  74.93 75.03 225 top
NOREF  -  [Pad_e1606]  91.86 7 0 top
NOREF#2  -  [Pad_e1604]  91.86 91.86 0 top
NOREF#3  -  [Pad_e1605]  7 7 0 top
NOREF#4  -  [Pad_e3904]  54.73 37.33 0 top
NOREF#5  -  [Pad_e302]  64.93 33.93 0 top
NOREF#6  -  [Pad_e297]  33.93 64.43 0 top
NOREF#7  -  [Pad_e303]  33.93 33.93 0 top
NOREF#8  -  [Pad_e2265]  44.23 37.53 0 top
NOREF#9  -  [Pad_e299]  64.93 64.43 0 top
NOREF#10  -  [Pad_e1603]  7 91.86 0 top
Q1  100N03A  [TO-252-2_L6.6-W6.1-P4.57-LS9.9-BR-CW]  18.93 79.93 315 top
Q2  100N03A  [TO-252-2_L6.6-W6.1-P4.57-LS9.9-BR-CW]  79.93 79.93 225 top
Q3  100N03A  [TO-252-2_L6.6-W6.1-P4.57-LS9.9-BR-CW]  79.93 18.93 135 top
Q4  100N03A  [TO-252-2_L6.6-W6.1-P4.57-LS9.9-BR-CW]  18.93 18.93 45 top
Q5  SI2302-HXY  [SOT-23-3_L2.9-W1.3-P1.90-LS2.4-BR]  39.66 38.34 180 top
Q6  100N03A  [TO-252-2_L6.6-W6.1-P4.57-LS9.9-BR-CW]  56.37 45.83 90 top
R1  10kΩ  [R0603]  21.93 21.93 135 top
R2  10kΩ  [R0603]  76.93 21.93 225 top
R3  10kΩ  [R0603]  76.93 76.93 315 top
R4  10kΩ  [R0603]  21.93 76.93 45 top
R5  470Ω  [R0603]  25.94 25.97 45 top
R6  470Ω  [R0603]  72.93 26.03 135 top
R7  470Ω  [R0603]  25.93 73.1 315 top
R8  470Ω  [R0603]  72.93 73.03 225 top
R9  10kΩ  [R0603]  37.26 38.34 270 top
R10  10kΩ  [R0603]  56.37 50.09 180 top
R13  10kΩ  [R0603]  44.8 50.57 270 top
R14  10kΩ  [R0603]  43.43 50.57 270 top
SW3  MK-12C03-G015  [SW-SMD_MK-12C03-G015]  58.23 32.73 0 top
U1  -  [NanoCell]  63.13 68.03 270 top
U2  -  [MPU-6050 module]  41.56 58.32 0 top
U5  XC6206P182MR  [SOT-23-3_L2.9-W1.6-P1.90-LS2.8-BR]  44.72 47.61 0 top
U6  ICM-20948  [QFN-24_L3.0-W3.0-P0.40-BL-EP]  49.43 49.43 0 top

## Footprints (pads in the part's own frame, mm; a bottom-side part is the same pattern mirrored in y, then rotated)
C0603
  rect 0.8x0.9 smd: 1(-0.7,0) 2(0.7,0)
C0805
  rect 1.41x1.35 smd: 1(-1,0) 2(1,0)
CONN-SMD_2P-P2.00
  rect 1x3.5 smd: 1(1,2.954) 2(-1,2.954)
  rect 1.8x4 smd: 3(-3.413,-2.954) 4(3.413,-2.954)
HDR-TH_2P-P3.50-V-M_1
  rect 2x2 hole 1.6x1: 1(-1.75,0)
  round 2 hole 1.6x1: 2(1.76,-0.005)
HDR-TH_TMM-101-06-L-S
  rect 1.5x1.5 hole 0.89: 1(0,0)
LED0603-RD_GREEN
  rect 0.8x0.8 smd: 1(-0.799,-0.004) 2(0.799,0.004)
LED0603-RD_RED
  rect 0.8x0.8 smd: 1(-0.799,-0.004) 2(0.799,0.004)
MPU-6050 module
  round 1.7 hole 1.27x1.1: 1(0,0) 2(0,-2.54) 3(0,-5.08) 4(0,-7.62) 5(0,-10.16) 6(0,-12.7) 7(0,-15.24) 8(0,-17.78)
NanoCell
  round 1.7 hole 1.1: 1(25.908,-2.286) 2(23.368,-2.286) 3(20.828,-2.286) 4(18.288,-2.286) 5(15.748,-2.286) 6(13.208,-2.286) 7(10.668,-2.286) 8(8.128,-2.286) 9(5.588,-2.286) 10(3.048,-2.286) 11(3.048,-25.146) 12(5.588,-25.146) 13(8.128,-25.146) 14(10.668,-25.146) 15(13.208,-25.146) 16(15.748,-25.146) 17(18.288,-25.146) 18(20.828,-25.146) 19(23.368,-25.146) 20(25.908,-25.146)
Pad_e297
  round 3 hole 2.5: 1(0,0)
Pad_e299
  round 3 hole 2.5: 1(0,0)
Pad_e302
  round 3 hole 2.5: 1(0,0)
Pad_e303
  round 3 hole 2.5: 1(0,0)
Pad_e1603
  round 10 hole 8.6: 1(0,0)
Pad_e1604
  round 10 hole 8.6: 2(0,0)
Pad_e1605
  round 10 hole 8.6: 3(0,0)
Pad_e1606
  round 10 hole 8.6: 4(0,0)
Pad_e2265
  round 1.7 hole 1.1: 1(0,0)
Pad_e3904
  round 1.7 hole 1.1: 2(0,0)
QFN-24_L3.0-W3.0-P0.40-BL-EP
  custom 0.2x0.506 smd: 1(-1,-1.427) 6(1,-1.427) 13(1,1.427) 18(-1,1.427)
  rect 0.2x0.505 smd: 2(-0.6,-1.427) 3(-0.2,-1.427) 4(0.2,-1.427) 5(0.6,-1.427) 14(0.6,1.427) 15(0.2,1.427) 16(-0.2,1.427) 17(-0.6,1.427)
  custom 0.506x0.2 smd: 7(1.427,-1) 12(1.427,1) 19(-1.427,1) 24(-1.427,-1)
  rect 0.505x0.2 smd: 8(1.427,-0.6) 9(1.427,-0.2) 10(1.427,0.2) 11(1.427,0.6) 20(-1.427,0.6) 21(-1.427,0.2) 22(-1.427,-0.2) 23(-1.427,-0.6)
  rect 1.7x1.7 smd: 25(0,0)
R0603
  rect 0.806x0.864 smd: 1(-0.753,0) 2(0.753,0)
SOT-23-3_L2.9-W1.3-P1.90-LS2.4-BR
  rect 1.25x0.7 smd: 1(1,-0.95) 2(1,0.95) 3(-1,0)
SOT-23-3_L2.9-W1.6-P1.90-LS2.8-BR
  rect 1.07x0.6 smd: 1(1.235,-0.95) 2(1.235,0.95) 3(-1.235,0)
SW-SMD_MK-12C03-G015
  rect 0.9x1.4 smd: 1(-2.251,1.558) 2(0.75,1.558) 3(2.25,1.558)
  rect 0.75x0.85 smd: 4(-3.375,0.592) 5(-3.375,-1.558) 6(3.375,0.567) 7(3.375,-1.558)
TO-252-2_L6.6-W6.1-P4.57-LS9.9-BR-CW
  rect 3x1.6 smd: 1(3.424,-2.29) 3(3.424,2.29)
  rect 6.2x5.8 smd: 2(-3.424,0)

## Nets
As in the schematic, except:
+VBAT: BAT.2 C15.2 C16.2 H1.2 H2.2 H3.2 H4.2 NOREF#8.1 R5.2 R6.2 R7.2 R8.2 SW3.3 U1.1
GND: C5.1 C6.1 C7.1 C09.1 C10.1 C11.1 C12.1 C15.1 C16.1 C17.1 C19.1 H7.1 NOREF#4.2 Q1.3 Q2.3 Q3.3 Q4.3 Q5.2 Q6.3 R1.2 R2.2 R3.2 R4.2 R9.2 R10.2 U1.12 U2.2 U5.1 U6.18 U6.20 U6.25
$1N11155: BAT.1 Q6.2

Pads without a net: BAT 3 4; NOREF 4; NOREF#2 2; NOREF#3 3; NOREF#5 1; NOREF#6 1; NOREF#7 1; NOREF#9 1; NOREF#10 1; SW3 1 4 5 6 7; U1 9 11 14 15 16; U2 7 8; U6 1 2 3 4 5 6 7 11 12 14 15 16 17 19 21

## Via types
v1: diameter 0.61, hole 0.305, Top Layer to Bottom Layer, 153 vias

## Routing (per net, layer and track width the routed paths; a pad name or vN(x,y) marks a point on that pad's centre or on a via; arc(x,y) is an arc through that point)
1.8V: length 12.4
  Top Layer w0.2: 51.9,48.48 51.55,48.83 U6.8
  Top Layer w0.254: R14.2 R13.2 45.96,48.66 U5.2
  Top Layer w0.5: 51.9,48.48 52.17,48.22 C5.2 51.72,47.55 51.17,47 48.37,47 47.46,47.91 46.6,47.91 U5.2
+3.3V: length 64.6
  Top Layer w0.2: U6.13 50.43,51.77 C6.2
  Top Layer w0.254: U2.1 54.83,58.32 55.59,57.57 v1(55.59,57.25) ; v1(50.22,53.34) 50.22,52.19 C6.2
  Top Layer w0.5: v1(47.14,44.41) 46.37,45.18 C19.2 45.87,45.21 44.42,46.67 43.84,46.67 43.49,47.02 U5.3
  Top Layer w1: U1.10 arc(60.68,64.87) 60.48,64.83 C12.2 C11.2 C10.2 C09.2 58.43,57.55 arc(58.42,57.5) H6.1
  Bottom Layer w0.5: v1(47.14,44.41) 48.96,42.59 52.02,42.59 56.42,47 56.42,49.58 52.67,53.34 v1(50.22,53.34) 54.12,57.25 v1(55.59,57.25) 58.29,57.25 58.32,57.28 arc(58.34,57.38) H6.1
+VBAT: length 266
  Top Layer w0.254: v1(72.8,70.77) 72.8,71.53 arc(72.7,72.06) R8.2 ; v1(60.53,36.03) 60.53,34.41 arc(60.52,34.35) SW3.3 ; v1(26.57,70.51) 26.57,72.29 arc(26.54,72.44) R7.2 ; v1(26.57,28.35) 26.52,28.3 26.52,26.52 arc(26.5,26.51) 26.47,26.5 ; R6.2 72.4,28 arc(72.44,28.19) v1(72.55,28.35)
  Top Layer w1: NOREF#8.1 43.9,37.86 C16.2 C15.2
  Bottom Layer w1: 60.54,33.95 arc(60.53,33.96) 60.53,33.97 60.53,41.36 arc(60.61,41.77) U1.1
  Bottom Layer w2: 11.79,84.59 28.41,67.98 35.15,67.98 arc(36.82,67.41) 38.56,67.12 arc(39.58,67.07) 40.6,67.12 arc(40.6,67.12) 40.61,67.12 41.79,67.12 arc(42.76,66.92) 43.59,66.37 45.33,64.63 45.33,61.88 arc(45.13,60.91) 44.58,60.09 43.81,59.31 43.81,38.56 arc(43.92,38) NOREF#8.1 ; 45.2,37.53 46.13,37.53 arc(47.02,37.69) 47.8,38.16 arc(47.86,38.22) 47.92,38.28 v1(48.43,38.79) ; 45.2,37.53 NOREF#8.1 ; 45.2,37.53 arc(45.11,37.65) 45.05,37.78 arc(45.03,37.87) 45.02,37.96 45.02,58.4 45.8,59.18 arc(46.35,60) 46.54,60.97 46.54,64.78 47.17,65.41 arc(47.99,65.96) 48.96,66.15 55.36,66.15 ; 87.07,14.27 72.44,28.89 arc(71.62,29.44) 70.65,29.64 65.92,29.64 arc(64.95,30.27) 63.92,30.8 61.26,33.46 arc(60.92,33.74) 60.54,33.95 arc(60.09,34.09) 59.63,34.13 51.28,34.13 arc(50.31,34.33) 49.49,34.88 48.63,35.73 arc(48.48,35.95) 48.43,36.22 v1(48.43,37.43) v1(48.43,38.79) ; v1(48.43,38.79) v1(48.43,40.03) ; 87.07,84.59 70.68,68.21 arc(69.86,67.66) 68.89,67.47 62.24,67.47 arc(60.27,67.11) 58.26,67.12 57.5,67.12 arc(56.53,66.92) 55.71,66.37 ; NOREF#8.1 42.99,37.53 arc(42.02,37.34) 41.2,36.79 35.4,30.99 arc(34.77,30.71) 34.15,30.4 28.98,30.4 arc(28.01,30.21) 27.18,29.66 11.79,14.27
GND: length 4.9
  Top Layer w0.2: v1(49.43,49.43) 48.83,50.03 U6.20 47.47,50.03 47.46,50.04 47.46,51.1 v1(47.3,51.26) ; 48.71,52.09 48.43,51.81 U6.18
  vias: v1(3.36,96.33) v1(3.36,87.33) v1(9.36,12.36) v1(12.36,9.36) v1(19.67,19.67) v1(20.25,79.68) v1(20.55,20.55) v1(21.01,17.82) v1(21.36,78.33) v1(21.36,21.36) v1(21.46,80.9) v1(24.36,21.36) v1(24.74,77.44) v1(26.02,75.12) v1(27.36,27.36) v1(27.36,24.36) v1(28.15,73.14) v1(28.67,28.67) v1(29.32,72.39) v1(29.98,71.47) v1(29.98,66.3) v1(30.13,27.85) v1(30.28,32.71) v1(31.8,69.65) v1(32.1,32.41) v1(32.1,28.46) v1(32.32,66.39) v1(34.08,37.12) v1(34.38,39.55) v1(35.14,58.55) v1(35.26,60.79) v1(35.3,41.22) v1(35.6,55.97) v1(35.87,37.24) v1(37.12,40.46) v1(39.55,58.7) v1(39.7,64.94) v1(39.7,57.34) v1(39.86,41.83) v1(40.01,44.26) v1(40.02,31.67) v1(41.32,63.39) v1(42.2,44.32) v1(42.32,51.92) v1(42.32,49.43) v1(42.74,64.94) v1(43.02,34.67) v1(43.02,31.67) v1(44.11,35.45) v1(45.94,67.22) v1(46.67,55.67) v1(46.7,57.49) v1(47,53.54) v1(47.3,46.7) v1(47.3,42.74) v1(47.46,45.33) v1(47.76,33.93) v1(48.37,41.83) v1(48.67,63.26) v1(48.67,61.51) v1(48.67,59.31) v1(48.67,57.49) v1(48.75,55.63) v1(48.82,53.54) v1(49.02,31.67) v1(49.74,41.83) v1(50.19,44.42) v1(50.58,55.67) v1(50.65,46.09) v1(50.8,64.51) v1(51.1,61.44) v1(51.1,59.31) v1(51.1,57.49) v1(51.16,52.33) v1(51.1,51.26) v1(51.26,43.66) v1(51.86,36.06) v1(52.32,56.73) v1(52.93,64.48) v1(52.93,62.5) v1(53.4,47.22) v1(53.69,59.16) v1(53.69,51.1) v1(53.99,55.82) v1(54.08,50.07) v1(54.08,49) v1(55.06,63.87) v1(55.06,61.44) v1(55.06,60.22) v1(55.29,49) v1(55.36,47.76) v1(56.42,55.36) v1(56.88,46.09) v1(57.18,35.9) v1(57.87,37.97) v1(57.94,46.24) v1(58.02,31.67) v1(59.31,53.54) v1(59.31,51.86) v1(59.46,37.88) v1(59.46,36.66) v1(62.05,55.97) v1(62.2,53.38) v1(62.2,39.1) v1(62.35,35.45) v1(62.55,63.56) v1(62.81,59.92) v1(63.26,40.62) v1(63.87,58.1) v1(64.67,61.67) v1(64.78,39.1) v1(65.09,69.34) v1(67.02,31.67) v1(67.37,64.48) v1(67.67,71.62) v1(67.82,27.24) v1(68.58,65.7) v1(69.8,25.26) v1(70.67,70.67) v1(71.62,23.44) v1(73.75,21.62) v1(77.4,20.25) v1(77.55,81.05) v1(77.7,17.82) v1(77.86,78.16) v1(78.62,79.98) v1(79.02,19.67) v1(87.11,3.36) v1(87.3,95.82) v1(87.3,86.82) v1(96.3,95.82)
P00: length 4.6
  Top Layer w0.254: R9.1 38.47,39.1 Q5.1 38.66,41.45 U1.20
P01: length 29.3
  Top Layer w0.2: v1(42.29,54.6) 50.95,54.6 53,52.55 53,49.74 52.5,49.23 50.86,49.23
  Bottom Layer w0.254: U1.19 39.7,46.38 39.7,53.54 40.77,54.6 v1(42.29,54.6)
P04: length 20.7
  Top Layer w0.2: v1(46.9,50.49) 46.9,50.03 47.7,49.23 48,49.23
  Top Layer w0.254: v1(51.41,44.57) 51.86,44.57 52.3,45 52.31,45 54.31,47 60.19,47 60.39,47.2 U1.3
  Bottom Layer w0.254: v1(46.9,50.49) 46.9,48.32 49.89,45.33 50.65,45.33 v1(51.41,44.57)
P05: length 63.5
  Top Layer w0.254: U1.4 60.85,48.8 62.05,47.6 62.05,40.46 60.38,38.79 53.38,38.79 50.8,36.21 35.51,36.21 35.5,36.2 35.02,36.2 35.01,36.21 33.02,36.21 31.04,34.23 31.04,26.94 23.84,19.73 Q4.1 22.97,20.17 arc(22.84,20.84) R1.1
P06: length 38.7
  Top Layer w0.254: U1.5 62.51,50.63 62.51,40.31 79.13,23.69 Q3.1 78.69,22.97 arc(78.03,22.84) R2.1
P07: length 51.2
  Top Layer w0.254: U1.6 60.01,55.66 57.64,55.66 56.88,56.42 56.88,57.18 49.91,64.15 41.7,64.15 39.1,66.76 36.21,66.76 26.53,76.44 23.25,76.44 23.21,76.4 R4.1 arc(20.84,76.02) 20.17,75.89 Q1.1 19.73,75.33
P08: length 29.1
  Top Layer w0.254: U1.7 61.71,57.36 76.6,72.25 76.6,77.27 R3.1 75.89,77.97 Q2.1
RX: length 6.1
  Top Layer w0.254: U1.13 40.6,59.9 H5.1
SCL: length 13.3
  Top Layer w0.2: U2.3 42.88,53.24 R13.1 45.11,51.33 47.6,48.83 U6.23
  Top Layer w0.254: U2.3 38.11,49.8 arc(38.05,49.76) U1.17
SDA: length 12.9
  Top Layer w0.2: U2.4 42.18,51.33 R14.1 44.22,50.53 45.29,50.53 47.39,48.43 U6.24
  Top Layer w0.254: U1.18 41.43,50.65 arc(41.49,50.69) U2.4
$1N990: length 5.5
  Top Layer w2: H3.1 83.1,13.29 arc(82.55,14.12) 82.35,15.09 82.35,16.51
$1N1042: length 5.5
  Top Layer w2: 16.51,16.51 16.51,15.09 arc(16.32,14.12) 15.77,13.29 H4.1
$1N1143: length 5.5
  Top Layer w2: 16.51,82.35 16.51,83.78 arc(16.48,84.18) 16.38,84.57 arc(16.13,85.11) 15.77,85.57 H1.1
$1N1147: length 5.5
  Top Layer w2: 82.35,82.35 82.35,83.78 arc(82.55,84.75) 83.1,85.57 H2.1
$1N3735: length 1.3
  Top Layer w0.254: LED1.2 25.39,25.43 arc(25.4,25.43) R5.1
$1N3774: length 1.3
  Top Layer w0.254: 74.36,24.6 73.47,25.49 arc(73.47,25.5) R6.1
$1N3813: length 1.2
  Top Layer w0.254: R7.1 24.59,74.43 arc(24.55,74.46) 24.5,74.47
$1N3852: length 1.3
  Top Layer w0.254: 74.37,74.46 73.47,73.57 arc(73.47,73.57) R8.1
$1N5655: length 171.7
  Top Layer w0.254: 36.34,38.34 34.08,38.34 22.98,27.24 22.98,23.79 23.37,23.4 ; 36.34,38.34 36.36,38.35 36.36,58.4 v1(33.85,60.91) 22.68,72.08 22.68,74.91 23.36,75.6 ; 36.34,38.34 40.66,38.34 Q5.3 ; 75.5,23.47 75.02,22.98 74.21,22.98 69.95,27.24 69.95,31.8 64.63,37.12 59.83,37.12 59.71,37.25 59.22,37.25 59.09,37.12 58.3,37.12 58.26,37.08 57.78,37.08 57.74,37.12 56.88,37.12 54.92,35.16 45,35.16 43.32,33.47 38.34,33.47 v1(36.82,34.99) ; 75.5,75.6 75.06,76.03 73.9,76.03 64.18,66.3 42.9,66.3 v1(41.83,65.24)
  Bottom Layer w0.254: v1(41.83,65.24) 40.31,63.72 36.66,63.72 33.93,60.98 ; v1(39.64,38.34) 36.82,35.51 v1(36.82,34.99)
$1N12497: length 15.9
  Top Layer w0.254: R10.1 57.83,50.09 Q6.1 ; SW3.2 58.98,35.74
  Bottom Layer w0.254: v1(58.66,48.19) 58.66,36.06 v1(58.98,35.74)
$2N590: length 1.6
  Top Layer w0.2: C7.2 51.46,49.63 U6.10

## Copper pours and planes (outline as drawn; the poured copper is in the pictures)
+VBAT on Bottom Layer: 43.39,41.23 49.45,41.23 49.45,36.63 43.39,36.63
GND on Top Layer: -12.43,108.56 130.45,108.56 141.85,97.16 141.85,12.19 112.06,-17.6 3.53,-17.6 -23.68,9.61 -23.68,97.31
GND on Bottom Layer: -14.41,112.06 91.54,112.06 108.26,95.34 108.26,0.03 93.06,-15.17 13.26,-15.17 -14.41,12.5
GND on Bottom Layer: 49.63,41.23 52.99,41.23 52.99,36.63 49.63,36.63
$1N11155 on Top Layer: 49.89,36.97 51.26,36.97 53.54,39.25 59.31,39.25 59.31,45.48 53.54,45.48 53.54,44.26 49.89,40.62
+VBAT on Top Layer: 42.9,40.52 48.95,40.52 48.95,36.87 48.96,36.65 48.93,36.43 45.88,36.43 44.39,36.39 42.9,36.4

## Text on the board
Bottom Silkscreen Layer: OFF | ON | + | -
Top Silkscreen Layer: OFF | ON | + | -
